# EAGLE design IN-2-Module (EAGLE 7.7.0)
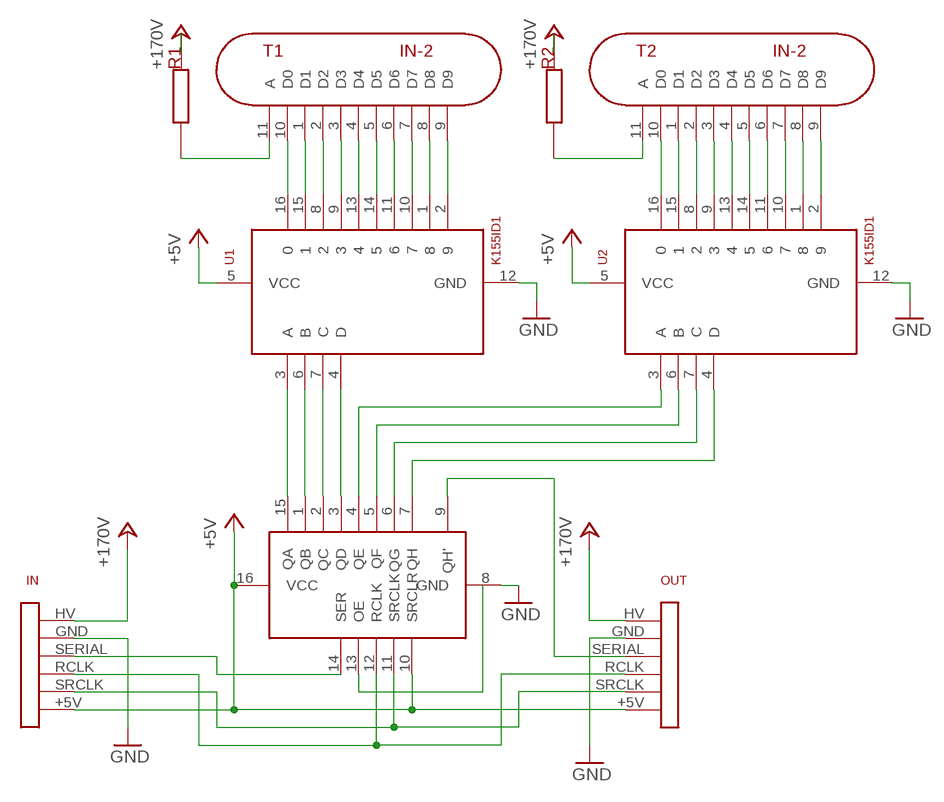
[diagram p0: schematic, sheet 1]

## Parts
IN  NIXIE_INTERCONNECTLEFT  [NIXIE_INTERCONNECT_LEFT]
OUT  NIXIE_INTERCONNECTRIGHT  [NIXIE_INTERCONNECT_RIGHT]
R1  22k  ANODE_RESISTOR  [ANODE_RESISTOR]
R2  22k  ANODE_RESISTOR  [ANODE_RESISTOR]
T1  IN-2  [IN-2]
T2  IN-2  [IN-2]
U1  K155ID1  [DIP16-2.54-19.2X7.62MM]
U2  K155ID1  [DIP16-2.54-19.2X7.62MM]
U3  74HC595  [DIL16]

## Nets
+5V: IN.+5V OUT.+5V U1.5(VCC) U2.5(VCC) U3.10(SRCLR) U3.16(VCC)
+24V: IN.HV OUT.HV R1.P$2 R2.P$2 ; supply symbol labelled +170V
GND: IN.GND OUT.GND U1.12(GND) U2.12(GND) U3.8(GND)
N$1: R1.P$1 T1.11(A)
N$2: T1.10(D0) U1.16
N$3: T1.1(D1) U1.15
N$4: T1.2(D2) U1.8
N$5: T1.3(D3) U1.9
N$6: T1.4(D4) U1.13
N$7: T1.5(D5) U1.14
N$8: T1.6(D6) U1.11
N$9: T1.7(D7) U1.10
N$10: T1.8(D8) U1.1
N$11: T1.9(D9) U1.2
N$12: R2.P$1 T2.11(A)
N$13: T2.10(D0) U2.16
N$14: T2.1(D1) U2.15
N$15: T2.2(D2) U2.8
N$16: T2.3(D3) U2.9
N$17: T2.4(D4) U2.13
N$18: T2.5(D5) U2.14
N$19: T2.6(D6) U2.11
N$20: T2.7(D7) U2.10
N$21: T2.8(D8) U2.1
N$22: T2.9(D9) U2.2
N$25: OUT.SERIAL U3.9(QH')
N$26: IN.SERIAL U3.14(SER)
N$27: IN.RCLK OUT.RCLK U3.12(RCLK)
N$29: IN.SRCLK OUT.SRCLK U3.11(SRCLK)
N$45: U3.13(OE)
N$67: U1.3(A) U3.15(QA)
N$68: U1.6(B) U3.1(QB)
N$69: U1.7(C) U3.2(QC)
N$70: U1.4(D) U3.3(QD)
N$71: U2.3(A) U3.4(QE)
N$72: U2.6(B) U3.5(QF)
N$73: U2.7(C) U3.6(QG)
N$74: U2.4(D) U3.7(QH)

## Library data of the parts
IN OUT = TimeExpander:NIXIE_INTERCONNECT
R1 R2 = TimeExpander:ANODE_RESISTOR: Anode resistor (Value is depending on drive voltage)
T1 T2 = TimeExpander:IN-2: Soviet IN-2 Nixie tube.
U1 U2 = TimeExpander:K155ID1: Soviet version of SN74141 BCD to Decimal Decoder / Nixie Driver
U3 = TimeExpander:74HC595: 8-Bit Shift Register

## Board
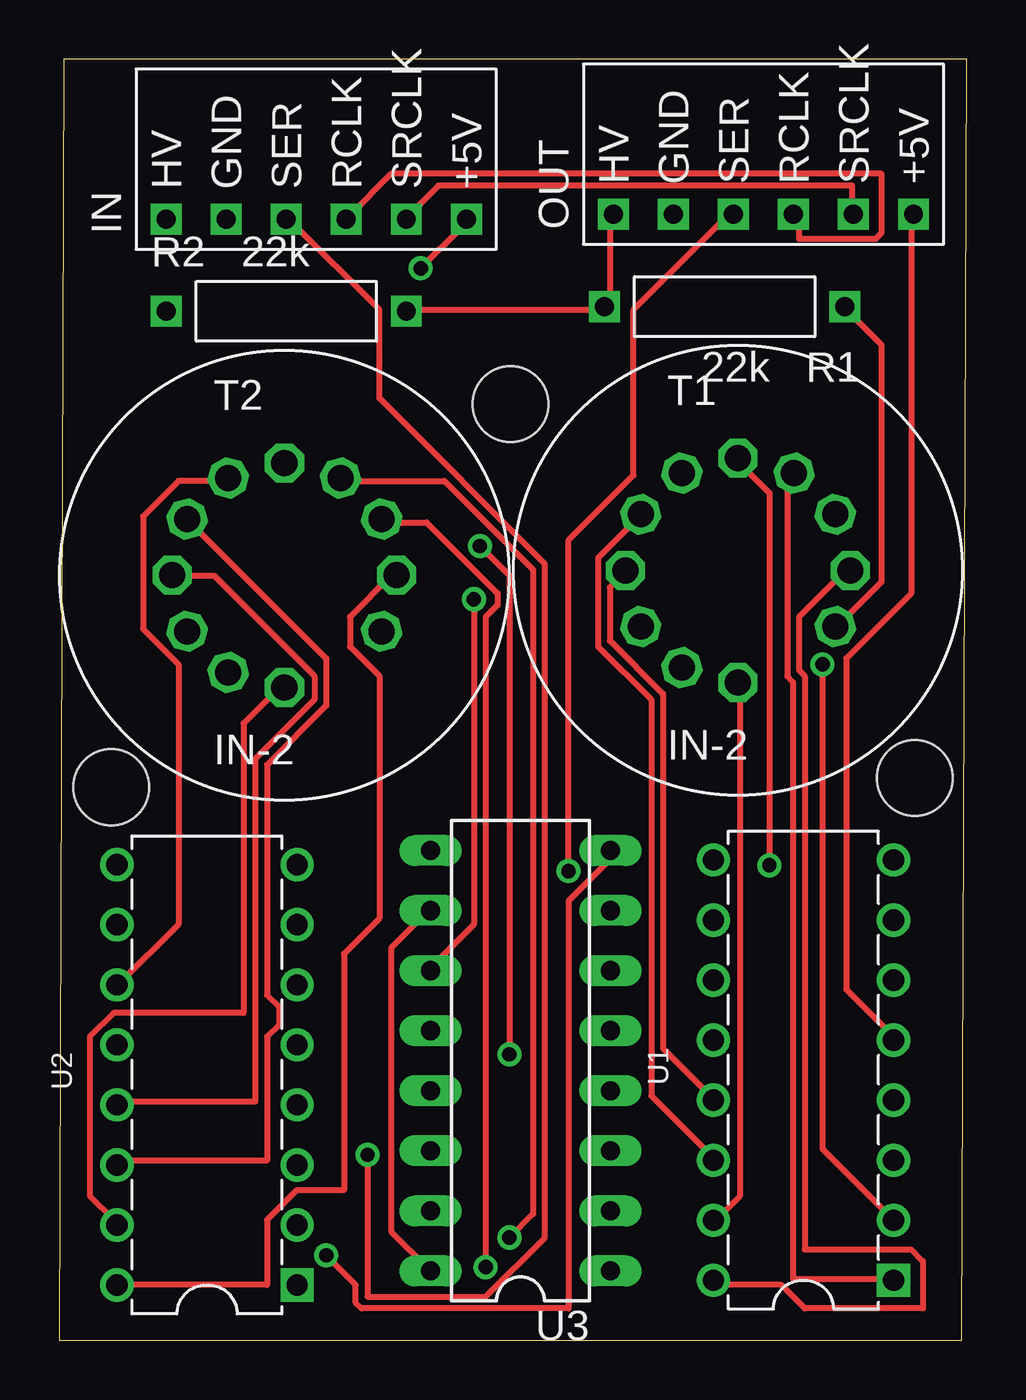
[diagram p1: board, top side]
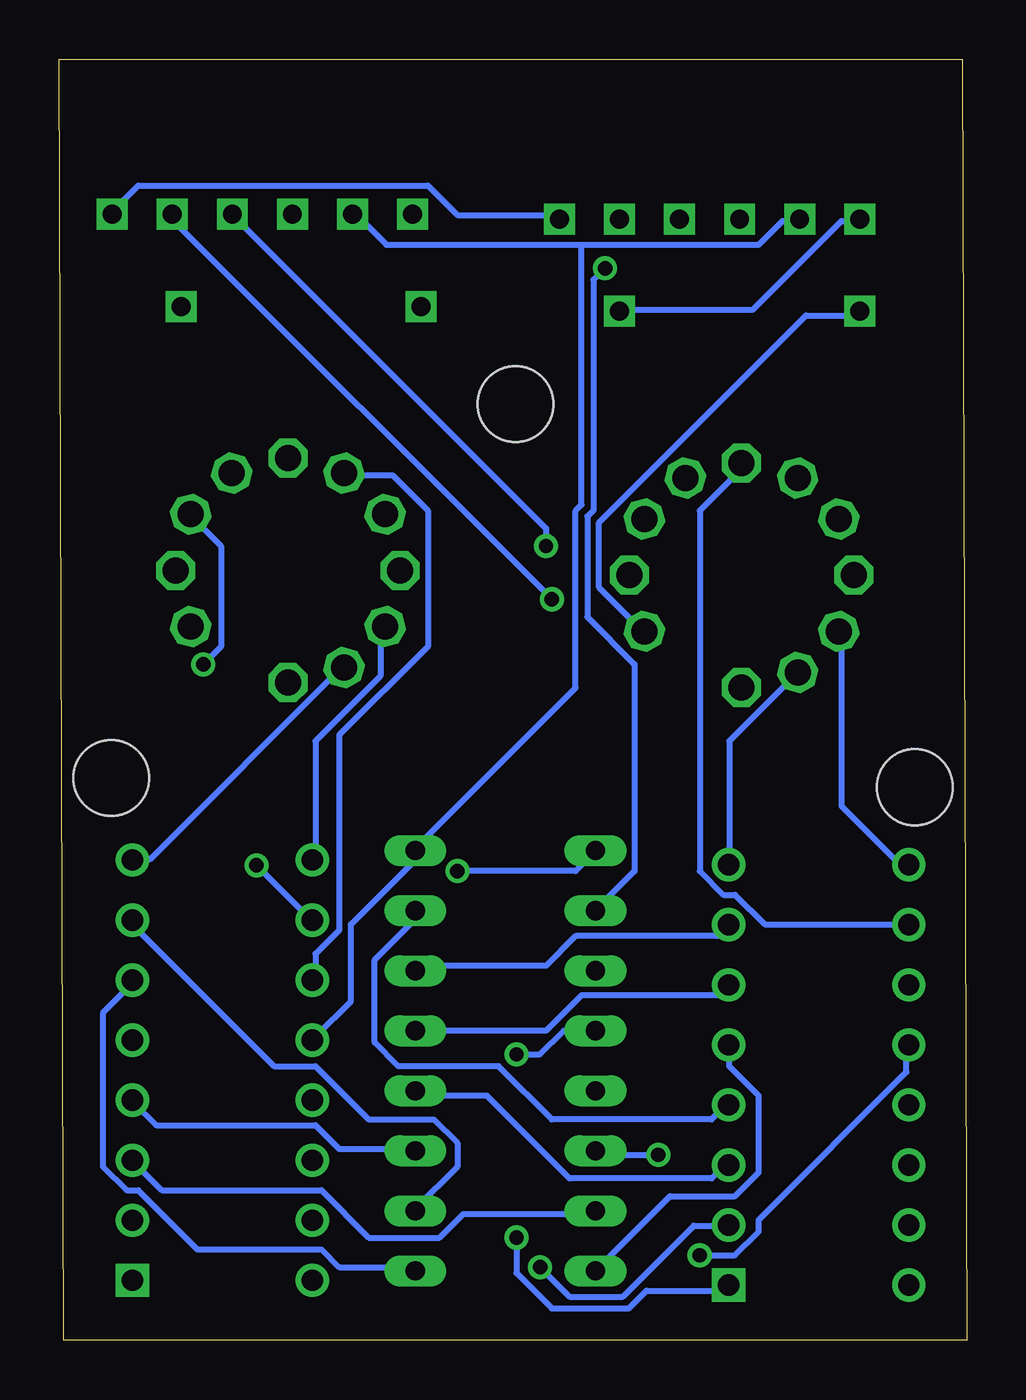
[diagram p2: board, bottom side, seen from below]

Size 38.4 x 54.2 mm. Coordinates in mm from the lower left corner, seen from the top.
Outline: 0,0 38.2,0 38.4,54.2 0.2,54.2 0,0
Copper layers (1*16): Top 0.035mm / dielectric 1.5mm / Bottom 0.035mm
Design rules "default": minimum track width 10mil, minimum drill 24mil, track to track 8mil, track to pad 8mil, pad to pad 8mil, via to via 8mil, smd to smd 8mil, copper to edge 40mil, drill to drill 8mil, minimum pad ring 10mil, minimum via ring 8mil, stop-mask expansion 4mil, vias tented up to drill 0mil, thermal gap 10mil
Holes 3.2 mm at 2.2,23.4 36.2,23.8 19.1,39.6

### Footprints (pad centres in the part's own frame; a part is rotated, then mirrored left to right if it is on the bottom)
NIXIE_INTERCONNECT = drill 0.8 square: +5V -10.16,-7.62; GND -10.16,2.54; HV -10.16,5.08; RCLK -10.16,-2.54; SERIAL -10.16,0; SRCLK -10.16,-5.08
ANODE_RESISTOR = drill 0.8 square: P$1 0,0; P$2 10.16,0
IN-2 = drill 1.1 octagon: 1 0,-4.75; 2 -2.375,-4.114; 3 -4.114,-2.375; 4 -4.75,0; 5 -4.114,2.375; 6 -2.375,4.114; 7 0,4.75; 8 2.375,4.114; 9 4.114,2.375; 10 4.75,0; 11 4.114,-2.375
DIP16-2.54-19.2X7.62MM = drill 0.9 pad 1.4 square: 1 -8.89,-3.81 | drill 0.9 pad 1.4: 2 -6.35,-3.81; 3 -3.81,-3.81; 4 -1.27,-3.81; 5 1.27,-3.81; 6 3.81,-3.81; 7 6.35,-3.81; 8 8.89,-3.81; 9 8.89,3.81; 10 6.35,3.81; 11 3.81,3.81; 12 1.27,3.81; 13 -1.27,3.81; 14 -3.81,3.81; 15 -6.35,3.81; 16 -8.89,3.81
DIL16 = drill 0.813 long: 1 -8.89,-3.81; 2 -6.35,-3.81; 3 -3.81,-3.81; 4 -1.27,-3.81; 5 1.27,-3.81; 6 3.81,-3.81; 7 6.35,-3.81; 8 8.89,-3.81; 9 8.89,3.81; 10 6.35,3.81; 11 3.81,3.81; 12 1.27,3.81; 13 -1.27,3.81; 14 -3.81,3.81; 15 -6.35,3.81; 16 -8.89,3.81

### Placement (x,y rotation side)
IN  NIXIE_INTERCONNECT  [NIXIE_INTERCONNECT]  9.61,57.59 90 top
OUT  NIXIE_INTERCONNECT  [NIXIE_INTERCONNECT]  28.53,57.8 90 top
R1  33.24,43.73 180 top
R2  4.53,43.53 0 top
T1  28.72,32.57 0 top
T2  9.53,32.37 0 top
U1  31.49,11.43 90 top
U2  6.26,11.23 90 top
U3  19.52,11.83 90 top

### Tracks (layer width: path | path; a pad name or v marks a point on that pad's centre or on a via)
+5V  (via drill 0.61)
  Top 0.254: U3.16 14.05,4.6 14.05,16.6 15.55,18.1 U3.10 | U1.5 35.3,12.85 33.3,14.85 33.3,28.85 36.05,31.6 36.05,47.6 OUT.+5V | v15.3,45.35 17.05,47.1 17.05,47.35 IN.+5V
  Bottom 0.254: U3.16 12.55,6.1 9.8,6.1 8.8,7.1 8.8,10.35 10.05,11.6 10.05,12.35 U2.5 | IN.+5V 17.3,47.6 21.55,47.6 22.8,48.85 35.05,48.85 36.05,47.85 OUT.+5V | v15.3,45.35 15.8,44.85 15.8,35.1 16.05,34.85 16.05,30.6 14.05,28.6 14.05,19.85 15.55,18.35 U3.10
+24V
  Top 0.254: OUT.HV 23.3,47.6 23.3,43.85 R1.P$2 23.05,43.6 14.8,43.6 R2.P$2
  Bottom 0.254: IN.HV 4.55,47.35 5.3,47.35 9.05,43.6 14.55,43.6 R2.P$2
GND  (via drill 0.61)
  Top 0.254: v11.3,3.6 12.55,2.35 12.55,1.6 12.8,1.35 21.55,1.35 21.55,18.6 23.3,20.35 23.3,20.6 U3.8
  Bottom 0.254: 16.3,46.35 24.55,46.35 25.8,47.6 OUT.GND | 16.3,46.35 8.8,46.35 7.8,47.35 7.3,47.35 IN.GND | U1.12 27.55,12.85 26.05,14.35 26.05,17.6 23.55,20.1 23.55,20.6 U3.8 23.3,20.85 16.55,27.6 16.55,35.1 16.3,35.35 16.3,46.35 | v11.3,3.6 9.8,3.6 8.8,4.6 8.8,5.1 2.55,11.35 2.55,12.35 U2.12
N$1
  Top 0.254: R1.P$1 33.3,43.6 34.8,42.1 34.8,32.1 33.05,30.35 T1.11
N$2
  Top 0.254: U1.16 27.8,2.35 30.55,2.35 31.55,1.35 36.55,1.35 36.55,3.35 36.05,3.85 31.55,3.85 31.55,28.1 31.3,28.35 31.3,30.6 33.3,32.6 T1.10
N$3
  Top 0.254: U1.15 27.8,5.1 28.8,6.1 28.8,27.6 T1.1
N$4
  Bottom 0.254: U1.8 35.3,20.35 34.55,20.35 26.55,28.35 T1.2
N$5
  Bottom 0.254: U1.9 27.55,20.35 27.55,25.35 24.8,28.1 24.8,30.1 T1.3
N$6
  Top 0.254: U1.13 27.55,10.35 25.55,12.35 25.55,27.35 23.3,29.6 23.3,31.85 23.8,32.35 T1.4
N$7
  Top 0.254: U1.14 27.55,7.85 25.05,10.35 25.05,27.1 22.8,29.35 22.8,33.1 24.55,34.85 T1.5
N$8
  Bottom 0.254: U1.11 27.55,15.35 27.55,16.35 26.55,17.35 26.55,25.6 22.8,29.35 22.8,35.1 24.3,36.6 26.3,36.6 T1.6
N$9  (via drill 0.61)
  Top 0.254: v30.05,20.1 30.05,35.85 28.8,37.1 T1.7
  Bottom 0.254: v30.05,20.1 27.8,17.85 U1.10
N$10
  Top 0.254: U1.1 35.3,2.6 31.05,2.6 31.05,27.85 30.8,28.1 30.8,36.35 31.05,36.6 T1.8
N$11  (via drill 0.61)
  Top 0.254: v32.3,28.6 32.3,8.1 35.3,5.1 U1.2
  Bottom 0.254: v32.3,28.6 31.55,29.35 31.55,33.6 32.8,34.85 T1.9
N$12
  Bottom 0.254: R2.P$1 4.55,43.35 6.8,43.35 15.55,34.6 15.55,31.85 13.8,30.1 T2.11
N$13
  Top 0.254: U2.16 2.55,2.35 8.8,2.35 8.8,5.1 10.05,6.35 12.05,6.35 12.05,16.35 13.55,17.85 13.55,28.1 12.3,29.35 12.3,30.6 14.05,32.35 T2.10
N$14
  Top 0.254: U2.15 2.3,5.1 1.3,6.1 1.3,12.85 2.3,13.85 7.8,13.85 7.8,26.1 9.3,27.6 T2.1
N$15
  Bottom 0.254: U2.8 10.05,20.35 10.05,25.35 7.3,28.1 T2.2
N$16
  Bottom 0.254: U2.9 2.55,20.35 3.05,20.35 5.3,22.6 5.3,29.85 T2.3
N$17
  Top 0.254: U2.13 2.55,10.1 8.3,10.1 8.3,24.6 10.8,27.1 10.8,28.1 6.55,32.35 4.8,32.35 T2.4
N$18
  Top 0.254: U2.14 2.55,7.6 8.8,7.6 8.8,12.85 9.3,13.35 9.3,14.1 8.8,14.6 8.8,24.35 11.3,26.85 11.3,28.85 5.55,34.6 T2.5
N$19
  Top 0.254: U2.11 2.55,15.1 5.05,17.6 5.05,28.6 3.55,30.1 3.55,34.85 5.05,36.35 7.05,36.35 T2.6
N$20
  Bottom 0.254: U2.10 2.55,17.6 8.55,17.6 9.8,18.85 10.3,18.85 11.3,19.85 11.3,35.1 9.3,37.1 T2.7
N$21  (via drill 0.61)
  Top 0.254: v19.05,4.35 20.05,5.35 20.05,32.6 16.3,36.35 12.05,36.35 T2.8
  Bottom 0.254: v19.05,4.35 19.05,2.85 17.55,1.35 14.3,1.35 13.55,2.1 10.3,2.1 U2.1
N$22  (via drill 0.61)
  Top 0.254: v18.05,3.1 18.05,30.6 18.55,31.1 18.55,31.6 15.55,34.6 13.8,34.6 T2.9
  Bottom 0.254: v18.05,3.1 16.8,1.85 14.55,1.85 11.55,4.85 10.3,4.85 U2.2
N$25  (via drill 0.61)
  Top 0.254: v21.55,19.85 21.55,33.85 24.3,36.6 24.3,43.6 28.3,47.6 OUT.SERIAL
  Bottom 0.254: v21.55,19.85 16.55,19.85 15.8,20.6 U3.9
N$26  (via drill 0.61)
  Top 0.254: v13.05,7.85 13.05,1.85 18.05,1.85 20.55,4.35 20.55,32.85 13.55,39.85 13.55,43.6 9.8,47.35 IN.SERIAL
  Bottom 0.254: v13.05,7.85 15.55,7.85 U3.14
N$27  (via drill 0.61)
  Top 0.254: IN.RCLK 12.3,47.6 14.05,49.35 34.8,49.35 34.8,46.85 34.55,46.6 31.3,46.6 31.3,47.6 OUT.RCLK | v19.05,12.1 19.05,32.35 v17.8,33.6
  Bottom 0.254: U3.12 17.05,13.1 18.05,12.1 v19.05,12.1 | v17.8,33.6 17.8,34.35 31.05,47.6 OUT.RCLK
N$29  (via drill 0.61)
  Top 0.254: IN.SRCLK 14.8,47.6 16.05,48.85 33.55,48.85 33.55,47.85 OUT.SRCLK | v17.55,31.35 17.55,17.6 15.8,15.85 U3.11
  Bottom 0.254: v17.55,31.35 33.8,47.6 OUT.SRCLK
N$67
  Bottom 0.254: U3.15 15.8,5.35 21.3,5.35 22.3,4.35 25.3,4.35 27.3,6.35 34.05,6.35 35.3,7.6 U1.3
N$68
  Bottom 0.254: U3.1 23.55,3.1 26.55,3.1 27.3,3.85 32.55,3.85 35.05,6.35 35.55,6.35 36.55,7.35 36.55,13.85 35.3,15.1 U1.6
N$69
  Bottom 0.254: U3.2 23.3,5.6 21.55,7.35 21.55,8.35 22.55,9.35 25.3,9.35 27.55,11.6 29.3,11.6 35.3,17.6 U1.7
N$70
  Bottom 0.254: U3.3 23.55,8.1 26.55,8.1 27.55,9.1 34.3,9.1 35.3,10.1 U1.4
N$71
  Bottom 0.254: U3.4 23.3,10.35 20.3,10.35 16.8,6.85 10.8,6.85 10.3,7.35 U2.3
N$72
  Bottom 0.254: U3.5 17.8,13.1 16.3,14.6 10.55,14.6 10.3,14.85 U2.6
N$73
  Bottom 0.254: U2.7 10.55,17.1 16.55,17.1 17.8,15.85 23.3,15.85 U3.6
N$74
  Bottom 0.254: U3.7 23.55,18.1 23.55,17.6 25.05,16.1 25.05,12.6 24.05,11.6 19.8,11.6 17.55,9.35 10.8,9.35 10.3,9.85 U2.4